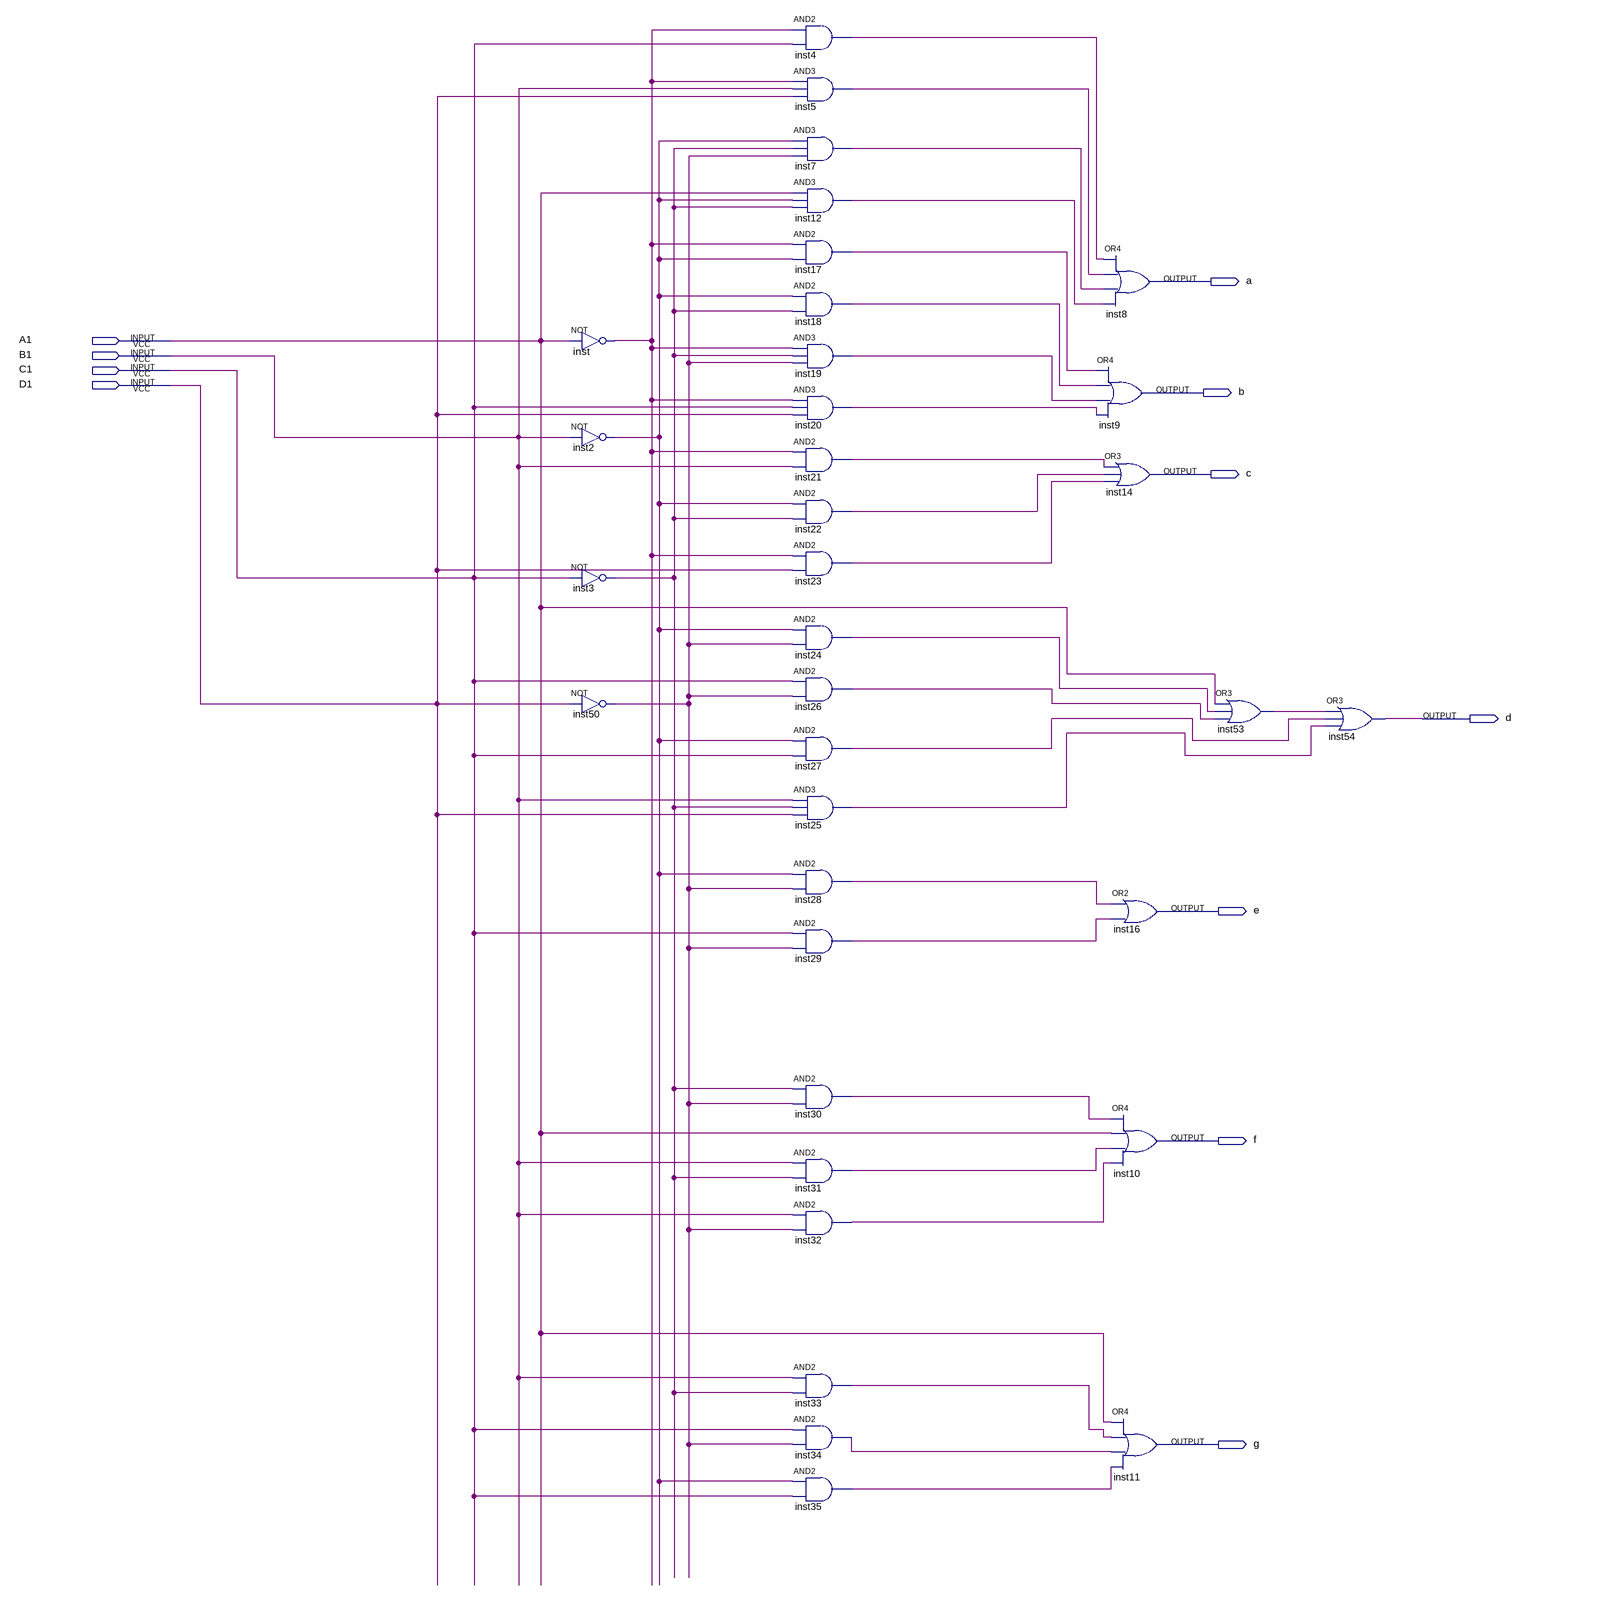
[diagram p0: schematic sheet]
// Quartus schematic b2seg.bdf as structural Verilog: 35 symbols, 11 pins
module b2seg (
  input  A1,
  input  B1,
  input  C1,
  input  D1,
  output a,
  output b,
  output c,
  output d,
  output e,
  output f,
  output g
);

  wire inst2_out, inst3_out, inst4_out, inst5_out, inst7_out, inst12_out, inst17_out, inst18_out, inst19_out,
       inst20_out, inst21_out, inst22_out, inst23_out, inst24_out, inst25_out, inst26_out, inst27_out,
       inst28_out, inst29_out, inst30_out, inst31_out, inst32_out, inst33_out, inst34_out, inst35_out,
       inst50_out, inst53_out, inst_out;

  not inst (inst_out, A1);
  not inst2 (inst2_out, B1);
  not inst3 (inst3_out, C1);
  not inst50 (inst50_out, D1);
  and inst4 (inst4_out, inst_out, C1);
  and inst5 (inst5_out, inst_out, B1, D1);
  and inst7 (inst7_out, inst2_out, inst3_out, inst50_out);
  and inst12 (inst12_out, A1, inst2_out, inst3_out);
  and inst17 (inst17_out, inst_out, inst2_out);
  and inst18 (inst18_out, inst2_out, inst3_out);
  and inst19 (inst19_out, inst_out, inst3_out, inst50_out);
  and inst20 (inst20_out, inst_out, C1, D1);
  and inst21 (inst21_out, inst_out, B1);
  and inst22 (inst22_out, inst2_out, inst3_out);
  and inst23 (inst23_out, inst_out, D1);
  and inst24 (inst24_out, inst2_out, inst50_out);
  and inst26 (inst26_out, C1, inst50_out);
  and inst27 (inst27_out, inst2_out, C1);
  and inst25 (inst25_out, B1, inst3_out, D1);
  and inst28 (inst28_out, inst2_out, inst50_out);
  and inst29 (inst29_out, C1, inst50_out);
  and inst30 (inst30_out, inst3_out, inst50_out);
  and inst31 (inst31_out, B1, inst3_out);
  and inst32 (inst32_out, B1, inst50_out);
  and inst33 (inst33_out, B1, inst3_out);
  and inst34 (inst34_out, C1, inst50_out);
  and inst35 (inst35_out, inst2_out, C1);
  or inst8 (a, inst4_out, inst5_out, inst7_out, inst12_out);
  or inst9 (b, inst17_out, inst18_out, inst19_out, inst20_out);
  or inst14 (c, inst21_out, inst22_out, inst23_out);
  or inst16 (e, inst28_out, inst29_out);
  or inst10 (f, inst30_out, A1, inst31_out, inst32_out);
  or inst11 (g, A1, inst33_out, inst34_out, inst35_out);
  or inst53 (inst53_out, A1, inst24_out, inst26_out);
  or inst54 (d, inst53_out, inst27_out, inst25_out);
endmodule
